# Altium schematic sheet BMS_rev2.SchDoc: BMS - AFE
size A4; DrawnBy: Jarod Krane; SheetTotal: 8
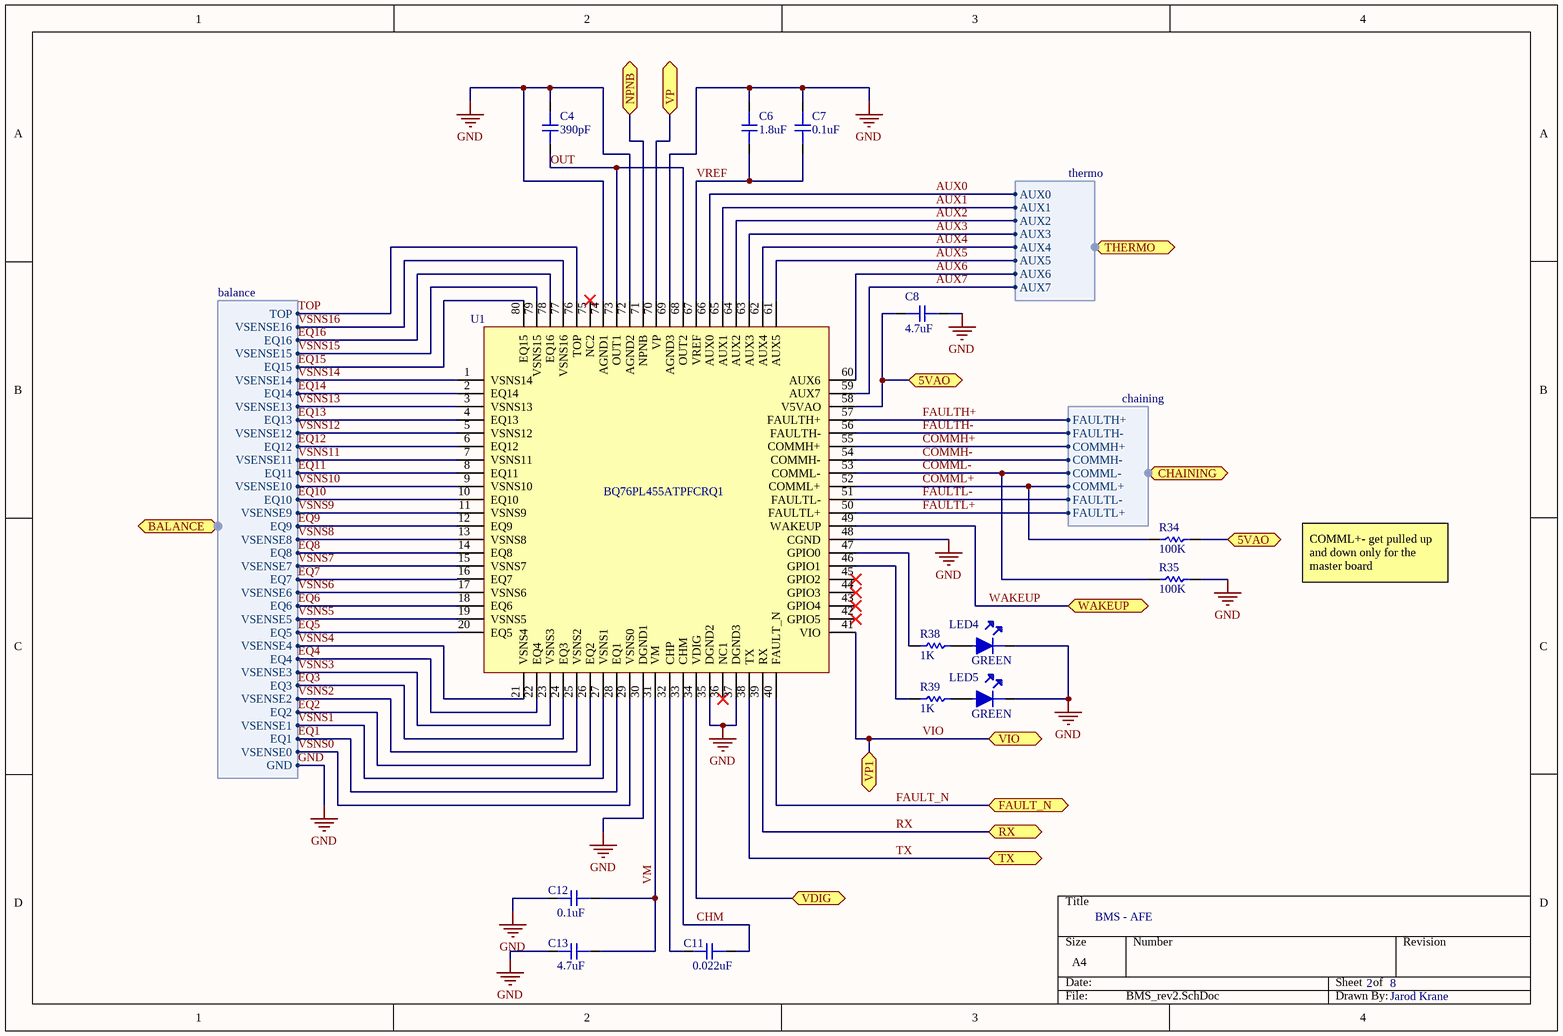
[diagram p0: BMS_rev2.SchDoc]

## Parts
C4  390pF  [0805 CAP]
C6  1.8uF  [1210 cap]
C7  0.1uF  [0603 CAP - duplicate]
C8  4.7uF  [0805 CAP]
C11  0.022uF  [0603 CAP - duplicate]
C12  0.1uF  [0603 CAP - duplicate]
C13  4.7uF  [0805 CAP]
LED4  GREEN  [LED2]
LED5  GREEN  [LED2]
R34  100K  [0603 RES]
R35  100K  [0603 RES]
R38  1K  [0603 RES]
R39  1K  [0603 RES]
U1  BQ76PL455ATPFCRQ1  [BQ76PL455A-Q1]

## Ports
5VAO, BALANCE (harness balance), CHAINING (harness chaining), FAULT_N, NPNB, RX, THERMO (harness thermo), TX, VDIG, VIO, VP, VP1, WAKEUP

## Harnesses
balance: TOP, VSENSE16, EQ16, VSENSE15, VSENSE13, EQ13, VSENSE12, EQ12, VSENSE11, EQ11, VSENSE10, EQ10, VSENSE9, EQ9, VSENSE8, EQ8, VSENSE7, EQ7, VSENSE6, EQ6, VSENSE5, EQ5, VSENSE4, EQ4, VSENSE3, EQ3, VSENSE2, EQ15, VSENSE14, EQ14, EQ2, VSENSE1, EQ1, VSENSE0, GND
chaining: FAULTH+, FAULTH-, COMMH+, COMMH-, COMML-, COMML+, FAULTL-, FAULTL+
thermo: AUX0, AUX1, AUX2, AUX3, AUX4, AUX5, AUX6, AUX7

## Nets
GND: C4.2 C6.2 C7.2 C8.2 C12.1 C13.1 LED4.2 LED5.2 R35.2 U1.30(DGND1) U1.35(DGND2) U1.37(DGND3) U1.48(CGND) U1.69(AGND3) U1.72(AGND2) U1.74(AGND1) ; port BALANCE.GND
5VAO: C8.1 R34.2 U1.58(V5VAO) ; port 5VAO
AUX0: U1.66(AUX0) ; port THERMO.AUX0
AUX1: U1.65(AUX1) ; port THERMO.AUX1
AUX2: U1.64(AUX2) ; port THERMO.AUX2
AUX3: U1.63(AUX3) ; port THERMO.AUX3
AUX4: U1.62(AUX4) ; port THERMO.AUX4
AUX5: U1.61(AUX5) ; port THERMO.AUX5
AUX6: U1.60(AUX6) ; port THERMO.AUX6
AUX7: U1.59(AUX7) ; port THERMO.AUX7
CHM: C11.2 U1.33(CHM)
COMMH+: U1.55(COMMH+) ; port CHAINING.COMMH+
COMMH-: U1.54(COMMH-) ; port CHAINING.COMMH-
COMML+: R34.1 U1.52(COMML+) ; port CHAINING.COMML+
COMML-: R35.1 U1.53(COMML-) ; port CHAINING.COMML-
EQ1: U1.28(EQ1) ; port BALANCE.EQ1
EQ2: U1.26(EQ2) ; port BALANCE.EQ2
EQ3: U1.24(EQ3) ; port BALANCE.EQ3
EQ4: U1.22(EQ4) ; port BALANCE.EQ4
EQ5: U1.20(EQ5) ; port BALANCE.EQ5
EQ6: U1.18(EQ6) ; port BALANCE.EQ6
EQ7: U1.16(EQ7) ; port BALANCE.EQ7
EQ8: U1.14(EQ8) ; port BALANCE.EQ8
EQ9: U1.12(EQ9) ; port BALANCE.EQ9
EQ10: U1.10(EQ10) ; port BALANCE.EQ10
EQ11: U1.8(EQ11) ; port BALANCE.EQ11
EQ12: U1.6(EQ12) ; port BALANCE.EQ12
EQ13: U1.4(EQ13) ; port BALANCE.EQ13
EQ14: U1.2(EQ14) ; port BALANCE.EQ14
EQ15: U1.80(EQ15) ; port BALANCE.EQ15
EQ16: U1.78(EQ16) ; port BALANCE.EQ16
FAULT_N: U1.40(FAULT_N) ; port FAULT_N
FAULTH+: U1.57(FAULTH+) ; port CHAINING.FAULTH+
FAULTH-: U1.56(FAULTH-) ; port CHAINING.FAULTH-
FAULTL+: U1.50(FAULTL+) ; port CHAINING.FAULTL+
FAULTL-: U1.51(FAULTL-) ; port CHAINING.FAULTL-
NPNB: U1.71(NPNB) ; port NPNB
OUT: C4.1 U1.68(OUT2) U1.73(OUT1)
RX: U1.39(RX) ; port RX
TOP: U1.76(TOP) ; port BALANCE.TOP
TX: U1.38(TX) ; port TX
VDIG: U1.34(VDIG) ; port VDIG
VIO: U1.41(VIO) ; port VP1, port VIO
VM: C12.2 C13.2 U1.31(VM)
VP: U1.70(VP) ; port VP
VREF: C6.1 C7.1 U1.67(VREF)
VSNS0: U1.29(VSNS0) ; port BALANCE.VSENSE0
VSNS1: U1.27(VSNS1) ; port BALANCE.VSENSE1
VSNS2: U1.25(VSNS2) ; port BALANCE.VSENSE2
VSNS3: U1.23(VSNS3) ; port BALANCE.VSENSE3
VSNS4: U1.21(VSNS4) ; port BALANCE.VSENSE4
VSNS5: U1.19(VSNS5) ; port BALANCE.VSENSE5
VSNS6: U1.17(VSNS6) ; port BALANCE.VSENSE6
VSNS7: U1.15(VSNS7) ; port BALANCE.VSENSE7
VSNS8: U1.13(VSNS8) ; port BALANCE.VSENSE8
VSNS9: U1.11(VSNS9) ; port BALANCE.VSENSE9
VSNS10: U1.9(VSNS10) ; port BALANCE.VSENSE10
VSNS11: U1.7(VSNS11) ; port BALANCE.VSENSE11
VSNS12: U1.5(VSNS12) ; port BALANCE.VSENSE12
VSNS13: U1.3(VSNS13) ; port BALANCE.VSENSE13
VSNS14: U1.1(VSNS14) ; port BALANCE.VSENSE14
VSNS15: U1.79(VSNS15) ; port BALANCE.VSENSE15
VSNS16: U1.77(VSNS16) ; port BALANCE.VSENSE16
WAKEUP: U1.49(WAKEUP) ; port WAKEUP
NetC11_1: C11.1 U1.32(CHP)
NetLED4_1: LED4.1 R38.2
NetLED5_1: LED5.1 R39.2
NetR38_1: R38.1 U1.47(GPIO0)
NetR39_1: R39.1 U1.46(GPIO1)

Not connected (* = marked no-connect by the designer): U1 36(NC1)* 42(GPIO5)* 43(GPIO4)* 44(GPIO3)* 45(GPIO2)* 75(NC2)*

## Notes on the sheet
- COMML+- get pulled up and down only for the master board
- 2

## Library data of the parts
C4 = 08055A391JAT2A: CAP CER 390PF 50V C0G/NP0 0805; Manufacturer: Kyocera AVX; Dielectric Material: Ceramic; Tolerance: 5%; Dielectric: C0G; Temperature Coefficient: 30ppm/°C; Supplier 1: Digi-Key; Manufacturer Part Number: 08055A391JAT2A; Stock 1: 18; Pricing 1: 1=0.22, 10=0.16, 100=0.075, 500=0.0526, 1000=0.0436 (USD); Mount: PCB,Surface Mount; Case/Package: 0805; Number of Pins: 2; Case Code (Imperial): 0805; Case Code (Metric): 2012; Contact Plating: Matte,Tin; Min Operating Temperature: -55°C; Max Operating Temperature: 125°C; Packaging: Tape and Reel; Capacitance: 390pF; Package Quantity: 1; Voltage Rating: 50V; Voltage Rating (DC): 50V; Termination: SMD/SMT; Voltage: 50V; Length: 2.01mm; Height: 0.94mm; Width: 1.25mm; Thickness: 0.037inch; Depth: 1.25mm; Radiation Hardening: No; REACH SVHC: No SVHC; Lead Free: Lead Free; Supplier Part Number 1: 478-1323-1-ND
C6 = C1210C185K3RACTU: CAP CER 1.8UF 25V X7R 1210; Manufacturer: KEMET; Dielectric Material: Ceramic; Tolerance: 10%; Dissipation Factor: 3.5%; Supplier 1: Digi-Key; Manufacturer Part Number: C1210C185K3RACTU; Stock 1: 3636; Pricing 1: 1=1.15, 10=0.876, 100=0.6267, 500=0.4852, 1000=0.4178 (USD); Mount: PCB,Surface Mount; Case/Package: 1210; Case Code (Metric): 3225; Case Code (Imperial): 1210; Min Operating Temperature: -55°C; Max Operating Temperature: 125°C; Package Quantity: 1; Capacitance: 1.8uF; Voltage Rating: 25V; Packaging: Tape and Reel; Voltage Rating (DC): 25V; Dielectric: X7R; Termination: SMD/SMT; Voltage: 25V; Length: 3.2mm; Height: 1.55mm; Width: 0.098inch; Thickness: 0.067inch; Depth: 2.5mm; REACH SVHC: No SVHC; Supplier Part Number 1: 399-3082-1-ND
C7 C12 = 06035C104KAZ2A: CAP CER 0.1UF 50V X7R 0603; Manufacturer: Kyocera AVX; Capacitance: 100nF; Tolerance: 10%; Temperature Coefficient: 30ppm/°C; Supplier 1: Digi-Key; Manufacturer Part Number: 06035C104KAZ2A; Stock 1: 40000; Pricing 1: 1=0.23, 10=0.161, 100=0.0756, 500=0.053, 1000=0.0439 (USD); Mount: PCB,Surface Mount; Case/Package: 0603; Number of Pins: 2; Case Code (Metric): 1608; Case Code (Imperial): 0603; Contact Plating: Matte,Tin; Min Operating Temperature: -55°C; Max Operating Temperature: 125°C; Package Quantity: 1; Voltage Rating: 50V; Packaging: Tape and Reel; Voltage Rating (DC): 50V; Dielectric: X7R; Termination: SMD/SMT; Voltage: 50V; Features: Soft Termination; Length: 1.6mm; Height: 0.94mm; Width: 0.032inch; Thickness: 0.035inch; Depth: 0.81mm; Radiation Hardening: No; REACH SVHC: No SVHC; Lead Free: Lead Free; Supplier Part Number 1: 478-3540-1-ND
C8 C13 = CL21B475KOFNFNE: CAP CER 4.7UF 16V X7R 0805; Manufacturer: Samsung; Tolerance: 10%; Supplier 1: Digi-Key; Manufacturer Part Number: CL21B475KOFNFNE; Stock 1: 20000; Pricing 1: 1=0.3, 10=0.208, 100=0.1181, 500=0.0833, 1000=0.0729 (USD); Mount: Surface Mount; Case/Package: 0805; Case Code (Metric): 2012; Case Code (Imperial): 0805; Min Operating Temperature: -55°C; Max Operating Temperature: 125°C; Package Quantity: 1; Packaging: Tape and Reel; Capacitance: 4.7uF; Voltage Rating: 16V; Dielectric: X7R; Length: 0.079inch; Height: 1.25mm; Width: 0.049inch; Thickness: 0.053inch; Depth: 1.25mm; Radiation Hardening: No; Supplier Part Number 1: 1276-2970-1-ND
C11 = C1608X7R1H223K080AA: CAP CER 0.022UF 50V X7R 0603; Manufacturer: TDK; Dielectric Material: Ceramic; Capacitance: 22nF; Tolerance: 10%; Supplier 1: Digi-Key; Manufacturer Part Number: C1608X7R1H223K080AA; Stock 1: 3; Pricing 1: 1=0.1, 10=0.074, 100=0.0331, 500=0.0237, 1000=0.0186 (USD); Mount: Surface Mount; Case/Package: 0603; Number of Pins: 2; Weight: 7.1E-05oz; Case Code (Metric): 1608; Case Code (Imperial): 0603; Min Operating Temperature: -55°C; Max Operating Temperature: 125°C; Package Quantity: 1; Voltage Rating: 50V; Packaging: Tape and Reel; Voltage Rating (DC): 50V; Dielectric: X7R; Termination: SMD/SMT; Composition: Ceramic; Voltage: 50V; Length: 1.6mm; Height: 0.8mm; Width: 0.031inch; Thickness: 0.037inch; Depth: 0.8mm; Radiation Hardening: No; REACH SVHC: No SVHC; Lead Free: Lead Free; Supplier Part Number 1: 445-1312-1-ND
LED4 LED5 = 150060VS75000: LED GREEN CLEAR 0603 SMD; Manufacturer: Wurth Electronics; Luminous Intensity: 40mcd; Viewing Angle: 140°; Forward Voltage: 2V; Wavelength: 570nm; Lens Style: Clear,Rectangular; Forward Current: 30mA; Test Current: 20mA; Supplier 1: Digi-Key; Manufacturer Part Number: 150060VS75000; Stock 1: 219425; Pricing 1: 1=0.14, 50=0.129, 100=0.11, 500=0.095 (USD); Mount: Surface Mount; Case/Package: 0603; Number of Pins: 2; Colour: Green; Case Code (Metric): 1608; Case Code (Imperial): 0603; Min Operating Temperature: -40°C; Max Operating Temperature: 85°C; Package Quantity: 1; Packaging: Tape and Reel; Dominant Wavelength: 570nm; Length: 1.6mm; Height: 0.7mm; Width: 0.8mm; REACH SVHC: Unknown; ComponentLink1URL: http://www.farnell.com/datasheets/1911347.pdf; ComponentLink1Description: http://www.farnell.com/datasheets/1911347.pdf; ComponentLink2URL: https://katalog.we-online.de/led/datasheet/150060VS75000.pdf; ComponentLink2Description: https://katalog.we-online.de/led/datasheet/150060VS75000.pdf; ComponentLink3URL: https://www.distrelec.biz/Web/Downloads/_t/ds/150060VS75000_eng_tds.pdf?mime=application%2Fpdf; ComponentLink3Description: https://www.distrelec.biz/Web/Downloads/_t/ds/150060VS75000_eng_tds.pdf?mime=application%2Fpdf; ComponentLink4URL: http://www.produktinfo.conrad.com/datenblaetter/750000-774999/759431-da-01-en-CHIPLED_0603_W_KL_H_GRUEN_150060VS7500.pdf; ComponentLink4Description: http://www.produktinfo.conrad.com/datenblaetter/750000-774999/759431-da-01-en-CHIPLED_0603_W_KL_H_GRUEN_150060VS7500.pdf; Supplier Part Number 1: 732-4980-1-ND
R34 R35 = ERJ-3EKF1003V: RES SMD 100K OHM 1% 1/10W 0603; Manufacturer: Panasonic; Manufacturer Part Number: ERJ3EKF-1003V; Resistance: 100kR; Power Rating: 100mW; Voltage Rating: 75V; Temperature Coefficient: 100ppm/°C; Supplier 1: Digi-Key; Stock 1: 10349154; Pricing 1: 1=0.1, 10=0.064, 100=0.0261, 1000=0.0117, 2500=0.0102 (USD); Case/Package: 0603; Number of Pins: 2; Case Code (Metric): 1608; Case Code (Imperial): 0603; Contact Plating: Tin; Min Operating Temperature: -55°C; Max Operating Temperature: 155°C; Tolerance: 1%; Packaging: Tape and Reel; Composition: Thick Film; Military Standard: Not; Voltage Rating (DC): 75V; Length: 1.6mm; Depth: 0.8mm; Width: 800um; Radiation Hardening: No; REACH SVHC: No SVHC; Lead Free: Lead Free; Supplier Part Number 1: P100KHCT-ND; Supplier 2: Digi-Key; Stock 2: 4435882; Pricing 2: 1=0.1, 10=0.024, 100=0.0097, 1000=0.0044, 2500=0.0038 (USD); Mount: Surface Mount; Package Quantity: 1; Number of Terminations: 2; Termination: SMD/SMT; Max Power Dissipation: 100mW; Features: Moisture Resistant; Height: 0.022inch; ComponentLink1URL: https://www.verical.com/server-webapp/html/getDatasheet?partID=323805&src-supplier=Verical; ComponentLink1Description: https://www.verical.com/server-webapp/html/getDatasheet?partID=323805&src-supplier=Verical; ComponentLink2URL: http://www.yageo.com/documents/recent/PYu-RC_Group_51_RoHS_L_10.pdf?src-supplier=Digi-Key; ComponentLink2Description: http://www.yageo.com/documents/recent/PYu-RC_Group_51_RoHS_L_10.pdf?src-supplier=Digi-Key; ComponentLink3URL: http://www.yageo.com/documents/recent/PYu-RC_Group_51_RoHS_L_9.pdf?src-supplier=Digi-Key; ComponentLink3Description: http://www.yageo.com/documents/recent/PYu-RC_Group_51_RoHS_L_9.pdf?src-supplier=Digi-Key; Supplier Part Number 2: 311-49.9KHRCT-ND
R38 R39 = CRCW06031K00FKEA: RES SMD 1K OHM 1% 1/10W 0603; Manufacturer: Vishay Dale; Resistance: 1kR; Power Rating: 100mW; Voltage Rating: 75V; Temperature Coefficient: 100ppm/°C; Supplier 1: Digi-Key; Manufacturer Part Number: CRCW06031K00FKEA; Stock 1: 3823619; Pricing 1: 1=0.1, 10=0.042, 100=0.017, 1000=0.0076, 2500=0.0066 (USD); Mount: Surface Mount; Case/Package: 0603; Number of Pins: 2; Weight: 7.1E-05oz; Case Code (Metric): 1608; Case Code (Imperial): 0603; Contact Plating: Tin; Min Operating Temperature: -55°C; Max Operating Temperature: 155°C; Composition: Thick Film; Tolerance: 1%; Packaging: Tape and Reel; Package Quantity: 10; Number of Terminations: 2; Termination: SMD/SMT; Military Standard: Not; Max Power Dissipation: 100mW; Voltage Rating (DC): 75V; Features: Automotive AEC-Q200; Length: 1.55mm; Height: 0.45mm; Width: 0.033inch; Depth: 0.85mm; Radiation Hardening: No; REACH SVHC: Unknown; Lead Free: Lead Free; Supplier Part Number 1: 541-1.00KHCT-ND
U1 = BQ76PL455ATPFCRQ1: IC BATT MONITOR/PROTECT 80TQFP; Manufacturer: Texas Instruments; Interface: UART; Fault Protection: Over/Under Voltage; Operating Supply Voltage: 22V; Supplier 1: Digi-Key; Manufacturer Part Number: BQ76PL455ATPFCRQ1; Stock 1: 0; Pricing 1: 1=19.03, 10=17.486, 100=14.7676, 500=13.1368 (USD); Mount: Surface Mount; Case/Package: TQFP; Number of Pins: 80; Min Operating Temperature: -40°C; Max Operating Temperature: 105°C; Packaging: Tape and Reel; Lead Free: Lead Free; Supplier Part Number 1: 296-44049-1-ND